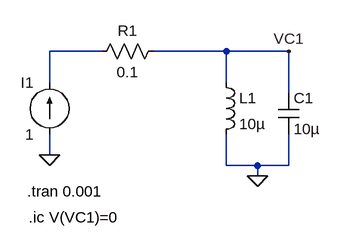
[diagram p0: schematic LC.asc]
LC.asc, the LTspice schematic file:
Version 4
SHEET 1 880 680
WIRE -64 64 -144 64
WIRE 128 64 16 64
WIRE 224 64 128 64
WIRE -144 112 -144 64
WIRE 128 112 128 64
WIRE 224 128 224 64
WIRE -144 224 -144 192
WIRE 128 240 128 192
WIRE 176 240 128 240
WIRE 224 240 224 192
WIRE 224 240 176 240
WIRE 176 256 176 240
FLAG -144 224 0
FLAG 176 256 0
FLAG 224 64 VC1
SYMBOL ind 112 96 R0
SYMATTR InstName L1
SYMATTR Value 10µ
SYMBOL cap 208 128 R0
SYMATTR InstName C1
SYMATTR Value 10µ
SYMBOL res 32 48 R90
WINDOW 0 0 56 VBottom 2
WINDOW 3 32 56 VTop 2
SYMATTR InstName R1
SYMATTR Value 0.1
SYMBOL current -144 192 R180
WINDOW 0 24 80 Left 2
WINDOW 3 24 0 Left 2
WINDOW 123 0 0 Left 0
WINDOW 39 0 0 Left 0
SYMATTR InstName I1
SYMATTR Value 1
TEXT -178 280 Left 2 !.tran 0.001
TEXT -176 320 Left 2 !.ic V(VC1)=0

The netlist it stands for:
* LC.asc
L1 VC1 0 10µ
C1 VC1 0 10µ
R1 VC1 N001 0.1
I1 0 N001 1
.tran 0.001
.ic V(VC1)=0
.backanno
.end